# EAGLE design kalypso-usb-v1 (EAGLE 7.7.0)
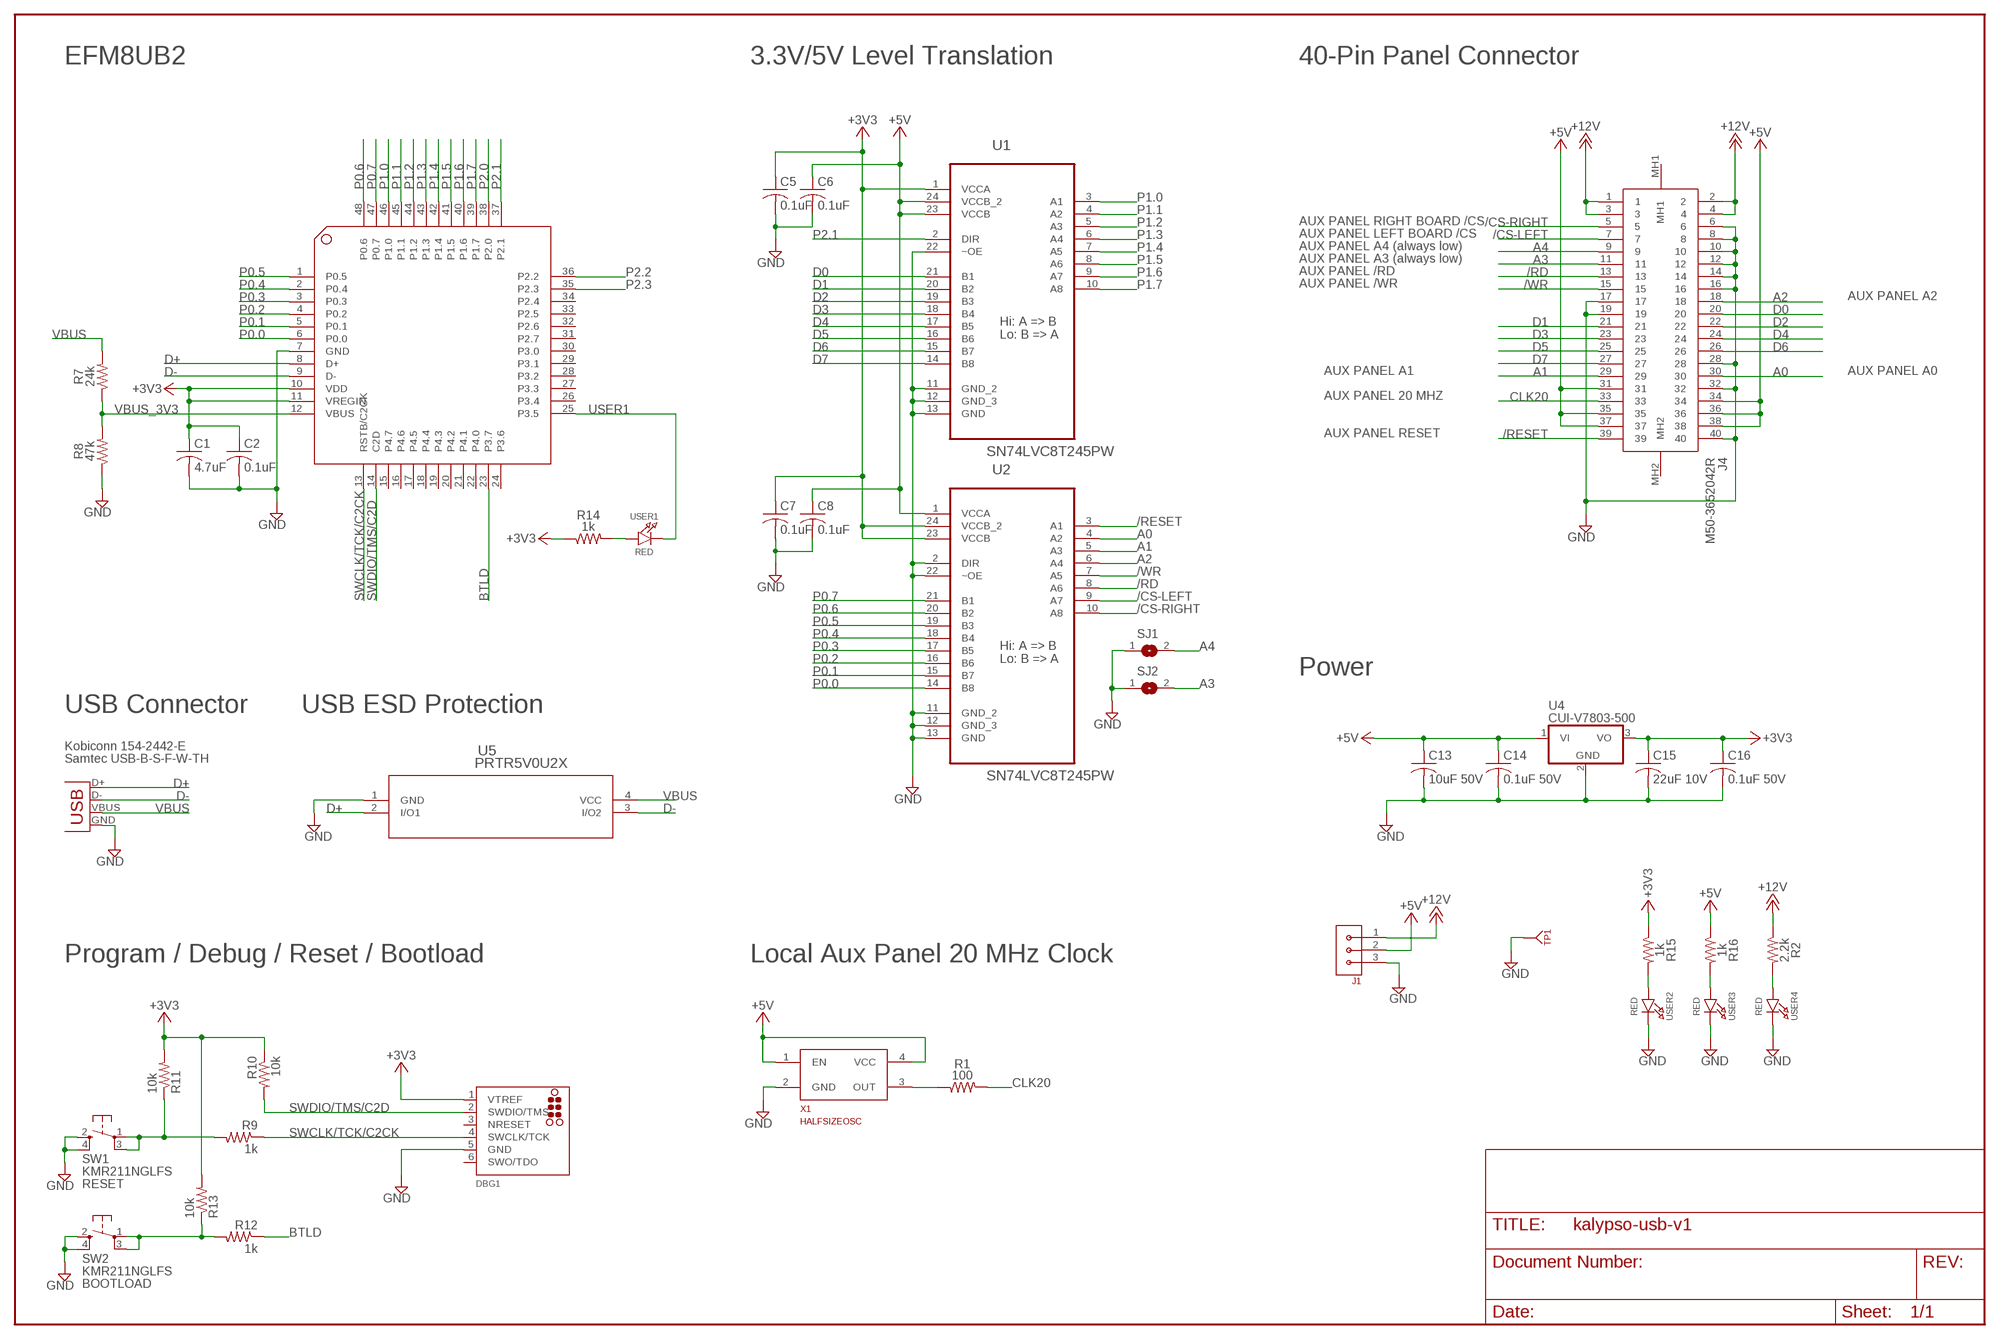
[diagram p0: schematic, sheet 1]

## Parts
C1  4.7uF  C-USC0805K  [C0805K]
C2  0.1uF  C-USC0603K  [C0603K]
C5  0.1uF  C-USC0603K  [C0603K]
C6  0.1uF  C-USC0603K  [C0603K]
C7  0.1uF  C-USC0603K  [C0603K]
C8  0.1uF  C-USC0603K  [C0603K]
C13  10uF 50V  C-USC1210K  [C1210K]
C14  0.1uF 50V  C-USC1206K  [C1206K]
C15  22uF 10V  C-USC1206K  [C1206K]
C16  0.1uF 50V  C-USC1206K  [C1206K]
DBG1  TC2030-CTX-SWD  [TC2030-MCP-NL]
J1  CON-3.81MM-1X3-PHOENIX-RA  [CON-PHOENIX-3.81-1X3-RA]
J2  USB-B  USBPTH  [USB-B-PTH]
J4  M50-3652042R  [M503652042R]
R1  100  R-US_R0603  [R0603]
R2  2.2k  R-US_R0603  [R0603]
R7  24k  R-US_R0603  [R0603]
R8  47k  R-US_R0603  [R0603]
R9  1k  R-US_R0603  [R0603]
R10  10k  R-US_R0603  [R0603]
R11  10k  R-US_R0603  [R0603]
R12  1k  R-US_R0603  [R0603]
R13  10k  R-US_R0603  [R0603]
R14  1k  R-US_R0603  [R0603]
R15  1k  R-US_R0603  [R0603]
R16  1k  R-US_R0603  [R0603]
SJ1  SJ  [SJ]
SJ2  SJ  [SJ]
SW1  KMR211NGLFS  SPST_TACT-KMR2  [KMR2]
SW2  KMR211NGLFS  SPST_TACT-KMR2  [KMR2]
TP1  KEYSTONE_500X  [KEYSTONE_TP500X]
U1  SN74LVC8T245PW  SN74AVC8T245PW  [SOP65P640X120-24N]
U2  SN74LVC8T245PW  SN74AVC8T245PW  [SOP65P640X120-24N]
U4  CUI-V7803-500  [CUI-78XX-500]
U5  PRTR5V0U2X  [SOT143B]
U6  EFM8UB20F64G-B-QFP48  [EFM8UB2-QFP48]
USER1  RED  LED0805_NOOUTLINE  [CHIPLED_0805_NOOUTLINE]
USER2  RED  LED0805_NOOUTLINE  [CHIPLED_0805_NOOUTLINE]
USER3  RED  LED0805_NOOUTLINE  [CHIPLED_0805_NOOUTLINE]
USER4  RED  LED0805_NOOUTLINE  [CHIPLED_0805_NOOUTLINE]
X1  HALFSIZEOSC  [HALFSIZEOSC]

## Nets
+3V3: C1.1 C2.1 C5.1 C7.1 C15.1 C16.1 DBG1.1(VTREF) R10.1 R11.2 R13.2 R14.1 R15.1 U1.1(VCCA) U2.23(VCCB) U2.24(VCCB_2) U4.3(VO) U6.10(VDD) U6.11(VREGIN)
+5V: C6.1 C8.1 C13.1 C14.1 J1.2 J4.31 J4.34 J4.35 J4.36 J4.37 J4.38 R16.1 U1.23(VCCB) U1.24(VCCB_2) U2.1(VCCA) U4.1(VI) X1.1(EN) X1.4(VCC)
+12V: J1.1 J4.1 J4.2 J4.3 J4.4 R2.1
/CS-LEFT: J4.7 U2.9(A7)
/CS-RIGHT: J4.5 U2.10(A8)
/RD: J4.13 U2.8(A6)
/RESET: J4.39 U2.3(A1)
/WR: J4.15 U2.7(A5)
A0: J4.30 U2.4(A2)
A1: J4.29 U2.5(A3)
A2: J4.18 U2.6(A4)
A3: J4.11 SJ2.2
A4: J4.9 SJ1.2
BTLD: R12.1 U6.23(P3.7)
CLK20: J4.33 R1.2
D0: J4.20 U1.21(B1)
D1: J4.21 U1.20(B2)
D2: J4.22 U1.19(B3)
D3: J4.23 U1.18(B4)
D4: J4.24 U1.17(B5)
D5: J4.25 U1.16(B6)
D6: J4.26 U1.15(B7)
D7: J4.27 U1.14(B8)
D+: J2.D+ U5.2(I/O1) U6.8(D+)
D-: J2.D- U5.3(I/O2) U6.9(D-)
GND: C1.2 C2.2 C5.2 C6.2 C7.2 C8.2 C13.2 C14.2 C15.2 C16.2 DBG1.5(GND) J1.3 J2.GND J4.6 J4.8 J4.10 J4.12 J4.14 J4.16 J4.17 J4.19 J4.28 J4.32 J4.40 R8.1 SJ1.1 SJ2.1 SW1.2(S) SW1.4(S1) SW2.2(S) SW2.4(S1) TP1.1 U1.11(GND_2) U1.12(GND_3) U1.13(GND) U1.22(~OE) U2.2(DIR) U2.11(GND_2) U2.12(GND_3) U2.13(GND) U2.22(~OE) U4.2(GND) U5.1(GND) U6.7(GND) USER2.C USER3.C USER4.C X1.2(GND)
N$1: R1.1 X1.3(OUT)
N$2: R14.2 USER1.A
N$3: R15.2 USER2.A
N$4: R16.2 USER3.A
N$5: R2.2 USER4.A
P0.0: U2.14(B8) U6.6(P0.0)
P0.1: U2.15(B7) U6.5(P0.1)
P0.2: U2.16(B6) U6.4(P0.2)
P0.3: U2.17(B5) U6.3(P0.3)
P0.4: U2.18(B4) U6.2(P0.4)
P0.5: U2.19(B3) U6.1(P0.5)
P0.6: U2.20(B2) U6.48(P0.6)
P0.7: U2.21(B1) U6.47(P0.7)
P1.0: U1.3(A1) U6.46(P1.0)
P1.1: U1.4(A2) U6.45(P1.1)
P1.2: U1.5(A3) U6.44(P1.2)
P1.3: U1.6(A4) U6.43(P1.3)
P1.4: U1.7(A5) U6.42(P1.4)
P1.5: U1.8(A6) U6.41(P1.5)
P1.6: U1.9(A7) U6.40(P1.6)
P1.7: U1.10(A8) U6.39(P1.7)
P2.0: U6.38(P2.0)
P2.1: U1.2(DIR) U6.37(P2.1)
P2.2: U6.36(P2.2)
P2.3: U6.35(P2.3)
SW1: R9.2 R11.1 SW1.1(P) SW1.3(P1)
SW2: R12.2 R13.1 SW2.1(P) SW2.3(P1)
SWCLK/TCK/C2CK: DBG1.4(SWCLK/TCK) R9.1 U6.13(RSTB/C2CK)
SWDIO/TMS/C2D: DBG1.2(SWDIO/TMS) R10.2 U6.14(C2D)
USER1: U6.25(P3.5) USER1.C
VBUS: J2.VBUS R7.2 U5.4(VCC)
VBUS_3V3: R7.1 R8.2 U6.12(VBUS)
Unconnected: DBG1.6(SWO/TDO) J4.MH1 J4.MH2 U6.15(P4.7) U6.16(P4.6) U6.17(P4.5) U6.18(P4.4) U6.19(P4.3) U6.20(P4.2) U6.21(P4.1) U6.22(P4.0) U6.24(P3.6) U6.26(P3.4) U6.27(P3.3) U6.28(P3.2) U6.29(P3.1) U6.30(P3.0) U6.31(P2.7) U6.32(P2.6) U6.33(P2.5) U6.34(P2.4)

## Notes on the sheet
- EFM8UB2 | 3.3V/5V Level Translation | 40-Pin Panel Connector
- AUX PANEL RIGHT BOARD /CS
- AUX PANEL LEFT BOARD /CS
- AUX PANEL A4 (always low)
- AUX PANEL A3 (always low)
- AUX PANEL /RD
- AUX PANEL /WR
- AUX PANEL A2
- Hi: A => B
  Lo: B => A
- AUX PANEL A1 | AUX PANEL A0
- AUX PANEL 20 MHZ
- AUX PANEL RESET
- Hi: A => B
  Lo: B => A
- Power
- USB Connector | USB ESD Protection
- Kobiconn 154-2442-E
- Samtec USB-B-S-F-W-TH
- Program / Debug / Reset / Bootload | Local Aux Panel 20 MHz Clock
- RESET
- BOOTLOAD

## Power pins joined to a net without a drawn wire
NRESET: DBG1.3(NRESET)

## Library data of the parts
C1 C2 C5-C8 = rcl:C-US: CAPACITOR, American symbol
C13 = rcl:C-US: CAPACITOR, American symbol; MFR: KEMET; MFR_PART_NO: C1210C106K5RACTU
C14 C16 = rcl:C-US: CAPACITOR, American symbol; MFR: KEMET; MFR_PART_NO: C1206S104M5RACTU
C15 = rcl:C-US: CAPACITOR, American symbol; MFR: KEMET; MFR_PART_NO: C1206C226K8RAC7800
DBG1 = tag-connect:TC2030-CTX-SWD
J1 = 0GlenConnectors:CON-3.81MM-1X3-PHOENIX-RA
J2 = SparkFun-Connectors:USB: USB Connectors USB-B-PTH is fully proven SKU : PRT-00139/CONN-08278 USB-miniB is fully proven SKU : PRT-00587 USB-A-PCB is untested. USB-A-H is throughly reviewed, but untested. Spark Fun Electronics SKU : PRT-00437 USB-B-SMT is throughly reviewed, but untested. Needs silkscreen touching up. USB-A-S has not been used/tested USB-MB-H has not been used/tested USB-MICROB has been used. CONN-09505; MFR: KOBICONN; MFR_PART_NO: 154-2442-E; PROD_ID: CONN-08278
J4 = M50-3652042R:M50-3652042R: HARWIN Archer M50, 1.27mm Pitch, 40 Way, 2 Row, Vertical PCB Header, Surface Mount Source: Datasheet <https://componentsearchengine.com/Datasheets/1/M50-3652042R.pdf>; ARROW_PART_NUMBER: M50-3652042R; DESCRIPTION: HARWIN Archer M50, 1.27mm Pitch, 40 Way, 2 Row, Vertical PCB Header, Surface Mount; HEIGHT: 11.6mm; MANUFACTURER_NAME: Harwin; MANUFACTURER_PART_NUMBER: M50-3652042R; MOUSER_PART_NUMBER: 855-M50-3652042R; MOUSER_PRICE-STOCK: https://www.mouser.co.uk/ProductDetail/Harwin/M50-3652042R?qs=gf2s0yP%252B7bfJki3ikJTXrQ%3D%3D
R1 R2 R7-R16 = rcl:R-US_: RESISTOR, American symbol
SJ1 SJ2 = jumper:SJ: SMD solder JUMPER
SW1 SW2 = adafruit:SPST_TACT: SMT 6mm switch, EVQQ2 series http://www.ladyada.net/library/eagle
TP1 = 0GlenConnectors:KEYSTONE_500X
U1 U2 = Texas Instruments_By_element14_Batch_1:SN74AVC8T245PW: TRANSCEIVER; MPN: SN74AVC8T245PW; OC_FARNELL: 1053490; OC_NEWARK: 10J9626; PACKAGE: TSSOP-24; SUPPLIER: Texas Instruments
U4 = GlenPartsLibrary:CUI-V7803-500
U5 = Nexperia_PRTR5V0U2X,215:PRTR5V0U2X; MANUFACTURER_PART_NUMBER: PRTR5V0U2X; VENDOR: NXP
U6 = Glen-EFM8UB2:EFM8UB20F64G-B-QFP48
USER1-USER4 = microbuilder:LED: LED 0603 - 0603 Surface Mount Package 2mA: Green LED - Low Power (3.9mcd, 2ma, 1.7Vf) - Digikey: 475-2709-2-ND Orange LED - Low Power (9.8mcd, 2ma, 1.8Vf) - Digikey: 475-1194-2-ND Red LED - Low Power (5mcd, 2ma, 1.8Vf) - Digikey: 475-1195-2-ND Yellow LED - Low Power (7mcd, 2ma, 1.8Vf) - Digikey: 475-1196-2-ND 5mA: Blue LED - Low Power (17mcd, 5ma, 2.9Vf) - Digikey: LNJ937W8CRACT-ND 0805 - 0805 Surface Mount Package 2mA: Red LED (8.8mcd, 2mA, 1.8Vf, Clear) - Low Power [Digikey: 475-2510-1-ND] Green LED (5mcd, 2mA, 1.8Vf, Clear) - Low Power [Digikey: 475-2730-1-ND] Yellow LED (11.3mcd, 2mA, 1.8Vf, Clear) - Low Power [Digikey: 475-2555-1-ND] 20mA: Red LED (104mcd, 20mA, Diffused) - LS R976 [Digikey: 475-1278-6-ND] Red LED (12mcd, 20mA, 2.0Vf, Clear) - APT2012EC [Digikey: 754-1128-1-ND] Green LED (15mcd, 20mA, 2.2Vf, Clear) - APT2012GC [Digikey: 754-1131-1-ND] Orange LED (160mcd, 20mA, 2.1Vf, Clear) - APT2012SECK [Digikey: 754-1130-1-ND] 1206 - 1206 Surface Mount Package Green LED (26mcd, 20mA, Diffused) - LG N971 [Digikey: 475-1407-6-ND] Red LED (15mcd, 20mA, Diffused) - LH N974 [Digikey: 475-1416-6-ND] Cree - Cree High-Power Surface Mount LEDs XPEBWT-L1-0000-00D50 - White 111lm 350mA 2.9Vf 6200K 110° XTEAWT-00-0000-00000LEE3 - White 114lm 350mA 2.85Vf 5000K 115° Everlight - Everlight 45-21 Series Surface Mount LEDs 45-21/QK2C-B2832AC2CB2/2T - Warm White 2000mcd 20mA 3.25Vf 3050K 120° 45-21/LK2C-B38452C4CB2/2T - Nuetral White 2000mcd 20mA 3.25Vf 4150K 120° 45-21/LK2C-B50634C6CB2/2T - Cold White 2200mcd 20mA 3.25Vf 5650K 120° PLCC2 Reverse Mount LS T77K-J1L2-1-0-2-R18-Z - Red 11.25mcd 2mA 1.8Vf 630nm 120° LO T77K-L1M2-24-Z - Orange 19.6mcd 2mA 1.8Vf 606nm 120° LY T77K-K2M1-26-Z - Yellow 15.7mcd 2mA 1.8Vf 587nm 120°
X1 = GlenPartsLibrary:HALFSIZEOSC

## Board
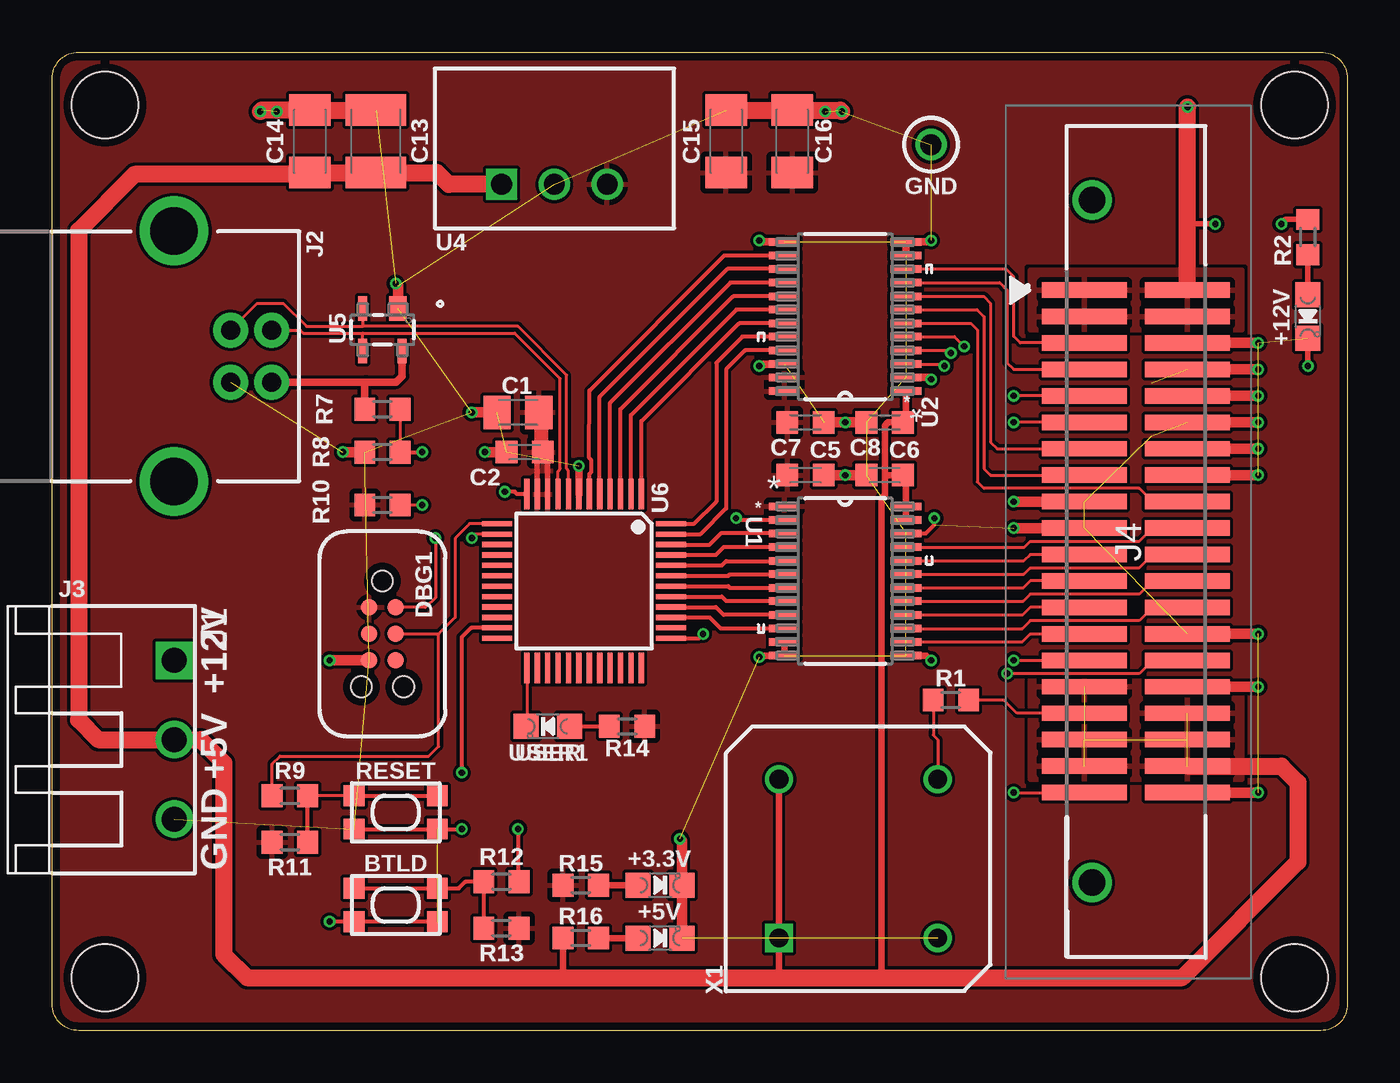
[diagram p1: board, top side]
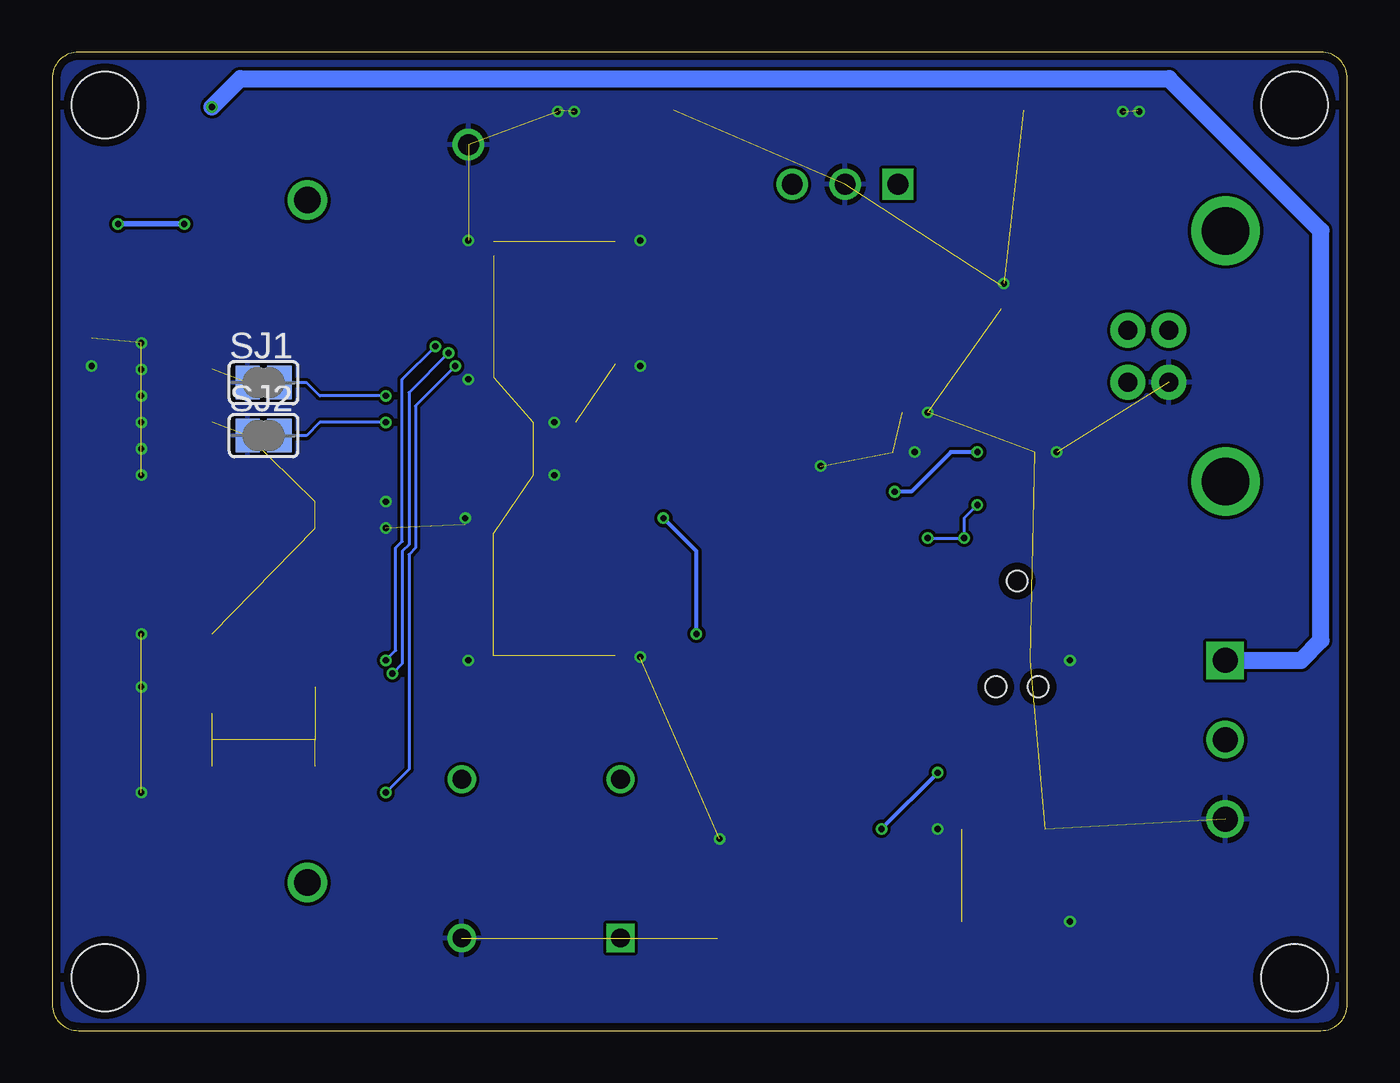
[diagram p2: board, bottom side, seen from below]

Size 62.23 x 46.99 mm. Coordinates in mm from the lower left corner, seen from the top.
Outline: 60.96,46.99 arc-90 62.23,45.72 62.23,1.27 arc-90 60.96,0 1.27,0 arc-90 0,1.27 0,45.72 arc-90 1.27,46.99 60.96,46.99
Copper layers (1*16): Top 0.035559375mm / dielectric 1.6mm / Bottom 0.035559375mm
Design rules "oshpark-2layer-2018": minimum track width 6mil, minimum drill 10mil, track to track 6mil, track to pad 6mil, pad to pad 6mil, via to via 6mil, smd to smd 6mil, copper to edge 15mil, drill to drill 6mil, minimum pad ring 5mil, minimum via ring 5mil, stop-mask expansion 2.5mil, vias tented up to drill 0mil, thermal gap 10mil
Holes 3.2 mm at 2.54,44.45 2.54,2.54 59.69,44.45 59.69,2.54

### Footprints (pad centres in the part's own frame; a part is rotated, then mirrored left to right if it is on the bottom)
C0805K = smd 1.3 x 1.6: 1 -1,0; 2 1,0
C0603K = smd 1.05 x 1.08: 1 -0.875,0; 2 0.875,0
C1210K = smd 1.5 x 2.9: 1 -1.5,0; 2 1.5,0
C1206K = smd 1.5 x 2: 1 -1.5,0; 2 1.5,0
TC2030-MCP-NL = smd 0.787 x 0.787: 1 1.27,-0.635; 2 1.27,0.635; 3 2.54,-0.635; 4 2.54,0.635; 5 3.81,-0.635; 6 3.81,0.635 | hole 0.991: 0,0; 5.08,-1.016; 5.08,1.016
CON-PHOENIX-3.81-1X3-RA = drill 1.2 square: 1 0,0 | drill 1.2: 2 3.81,0; 3 7.62,0
USB-B-PTH = drill 0.914 pad 1.676: D+ 0,1.25; D- 1.981,1.25; GND 0,-1.25; VBUS 1.981,-1.25 | drill 2.286: S1 -2.718,-6.02; S2 -2.718,6.02
M503652042R = smd 0.74 x 4.09: 1 -12.065,-2.475; 2 -12.065,2.475; 3 -10.795,-2.475; 4 -10.795,2.475; 5 -9.525,-2.475; 6 -9.525,2.475; 7 -8.255,-2.475; 8 -8.255,2.475; 9 -6.985,-2.475; 10 -6.985,2.475; 11 -5.715,-2.475; 12 -5.715,2.475; 13 -4.445,-2.475; 14 -4.445,2.475; 15 -3.175,-2.475; 16 -3.175,2.475; 17 -1.905,-2.475; 18 -1.905,2.475; 19 -0.635,-2.475; 20 -0.635,2.475; 21 0.635,-2.475; 22 0.635,2.475; 23 1.905,-2.475; 24 1.905,2.475; 25 3.175,-2.475; 26 3.175,2.475; 27 4.445,-2.475; 28 4.445,2.475; 29 5.715,-2.475; 30 5.715,2.475; 31 6.985,-2.475; 32 6.985,2.475; 33 8.255,-2.475; 34 8.255,2.475; 35 9.525,-2.475; 36 9.525,2.475; 37 10.795,-2.475; 38 10.795,2.475; 39 12.065,-2.475; 40 12.065,2.475 | drill 1.27 pad 1.905: MH1 -16.385,-2.11; MH2 16.385,-2.11
R0603 = smd 1 x 1.1: 1 -0.85,0; 2 0.85,0
SJ = smd 1.168 x 1.6: 1 -0.762,0; 2 0.762,0
KMR2 = smd 1 x 1: 1 2,0.8; 2 2,-0.8; 3 -2,0.8; 4 -2,-0.8
KEYSTONE_TP500X = drill 1.016: 1 0,0
SOP65P640X120-24N = smd 1.473 x 0.356: 1 -2.921,3.581; 2 -2.921,2.921; 3 -2.921,2.286; 4 -2.921,1.626; 5 -2.921,0.965; 6 -2.921,0.33; 7 -2.921,-0.33; 8 -2.921,-0.965; 9 -2.921,-1.626; 10 -2.921,-2.286; 11 -2.921,-2.921; 12 -2.921,-3.581; 13 2.921,-3.581; 14 2.921,-2.921; 15 2.921,-2.286; 16 2.921,-1.626; 17 2.921,-0.965; 18 2.921,-0.33; 19 2.921,0.33; 20 2.921,0.965; 21 2.921,1.626; 22 2.921,2.286; 23 2.921,2.921; 24 2.921,3.581
CUI-78XX-500 = drill 1 square: 1 0,0 | drill 1: 2 2.54,0; 3 5.08,0
SOT143B = smd 0.838 x 1.168: 1 -0.747,-1.016 | smd 0.432 x 1.168: 2 0.95,-1.016; 3 0.95,1.016; 4 -0.95,1.016
EFM8UB2-QFP48 = smd 1.45 x 0.25: 1 -4.175,2.75; 2 -4.175,2.25; 3 -4.175,1.75; 4 -4.175,1.25; 5 -4.175,0.75; 6 -4.175,0.25; 7 -4.175,-0.25; 8 -4.175,-0.75; 9 -4.175,-1.25; 10 -4.175,-1.75; 11 -4.175,-2.25; 12 -4.175,-2.75; 25 4.175,-2.75; 26 4.175,-2.25; 27 4.175,-1.75; 28 4.175,-1.25; 29 4.175,-0.75; 30 4.175,-0.25; 31 4.175,0.25; 32 4.175,0.75; 33 4.175,1.25; 34 4.175,1.75; 35 4.175,2.25; 36 4.175,2.75 | smd 0.25 x 1.45: 13 -2.75,-4.175; 14 -2.25,-4.175; 15 -1.75,-4.175; 16 -1.25,-4.175; 17 -0.75,-4.175; 18 -0.25,-4.175; 19 0.25,-4.175; 20 0.75,-4.175; 21 1.25,-4.175; 22 1.75,-4.175; 23 2.25,-4.175; 24 2.75,-4.175; 37 2.75,4.175; 38 2.25,4.175; 39 1.75,4.175; 40 1.25,4.175; 41 0.75,4.175; 42 0.25,4.175; 43 -0.25,4.175; 44 -0.75,4.175; 45 -1.25,4.175; 46 -1.75,4.175; 47 -2.25,4.175; 48 -2.75,4.175
CHIPLED_0805_NOOUTLINE = smd 1.2 x 1.2: A 0,-1.05; C 0,1.05
HALFSIZEOSC = drill 0.9 square: 1 0,0 | drill 0.9: 2 7.62,0; 3 7.62,7.62; 4 0,7.62

### Placement (x,y rotation side)
C1  22.38,29.69 180 top
C2  22.7,27.78 180 top
C5  36.2,26.67 0 top
C6  40.01,26.67 180 top
C7  36.2,29.21 0 top
C8  40.01,29.21 180 top
C13  15.56,42.7 90 top
C14  12.38,42.7 90 top
C15  32.38,42.7 90 top
C16  35.56,42.7 90 top
DBG1  15.88,21.59 270 top
J1  5.87,17.78 270 top
J2  8.57,32.38 0 top
J4  52.07,23.5 270 top
R1  43.18,15.88 0 top
R2  60.33,38.1 270 top
R7  15.88,29.84 180 top
R8  15.88,27.78 0 top
R9  11.43,11.27 0 top
R10  15.88,25.24 0 top
R11  11.43,9.05 180 top
R12  21.59,7.14 180 top
R13  21.59,4.92 0 top
R14  27.62,14.61 180 top
R15  25.4,6.99 0 top
R16  25.4,4.45 0 top
SJ1  52.07,31.11 0 bottom
SJ2  52.07,28.57 0 bottom
SW1  16.51,10.48 0 top
SW2  16.51,6.03 0 top
TP1  42.23,42.55 180 top
U1  38.1,21.59 0 top
U2  38.1,34.29 180 top
U4  21.59,40.64 0 top
U5  15.88,33.66 180 top
U6  25.56,21.59 270 top
USER1  23.81,14.61 90 top
USER2  29.21,6.99 270 top
USER3  29.21,4.45 270 top
USER4  60.33,34.29 180 top
X1  34.92,4.45 0 top

### Tracks (layer width: path | path; a pad name or v marks a point on that pad's centre or on a via)
+3V3
  Top 0.254: U6.11 23.31,27.51 C2.1 | U6.10 23.81,27.55 C2.1 | C2.1 23.58,29.49 C1.1
  Top 0.305: 35.18,26.81 C5.1
  Top 0.356: 23.34,29.05 23.34,28.1 | 23.65,29.05 23.65,28.1
  pour Top (isolate 0.152, rank 2): 62.23,46.99 62.23,0 0,0 0,46.99
+5V  (5 unrouted)
  Top 0.305: 41.02,26.81 C6.1 | R16.1 24.55,2.6 24.61,2.54 | U2.1 41.02,29.35 C8.1 40.16,29.21 40.01,29.05 40.01,26.67 | 40.01,26.67 40.01,25.72 39.85,25.56 39.85,2.54 | U1.23 U1.24 41.02,26.53 C6.1 | C6.1 40.01,26.67 | 34.92,2.54 X1.1 X1.4
  Top 0.813: J4.38 59.05,12.7 59.85,11.91 59.85,8.1 54.29,2.54 39.85,2.54 34.92,2.54 24.61,2.54 9.37,2.54 8.26,3.65 8.26,12.86 7.14,13.97 J1.2 2.22,13.97 1.27,14.92 1.27,38.42 3.97,41.12 12.29,41.12 C14.1 C13.1 18.49,41.2 19.05,40.64 U4.1
  pour Top (isolate 0.152): 57.15,17.14 57.15,12.06 46.99,12.06 46.99,17.14
+12V  (via drill 0.3)
  Top 0.254: R2.1 59.27,38.95 v59.05,38.73 | v55.88,38.73 54.55,38.73
  Top 0.813: J4.2 54.55,38.73 v54.55,44.36
  Bottom 0.254: v59.05,38.73 v55.88,38.73
  Bottom 0.813: v54.55,44.36 53.18,45.72 8.57,45.72 1.27,38.42 1.27,18.73 2.22,17.78 J1.1
  pour Top (isolate 0.152): 57.15,36.51 57.15,33.66 46.99,33.66 46.99,36.51
/CS-LEFT
  Top 0.152: U2.9 45.52,35.92 45.88,35.56 45.88,32.07 46.2,31.75 J4.7
/CS-RIGHT
  Top 0.152: J4.5 46.51,33.02 46.2,33.34 46.2,36.2 45.81,36.58 U2.10
/RD
  Top 0.152: U2.8 44.76,35.26 45.09,34.92 45.09,28.26 45.4,27.94 J4.13
/RESET  (via drill 0.3)
  Top 0.152: U2.3 42.77,32 v42.86,31.91 | v46.2,11.43 J4.39
  Bottom 0.152: v42.86,31.91 44.77,30 44.77,23.18 45.09,22.86 45.09,12.54 v46.2,11.43
/WR
  Top 0.152: U2.7 44.44,34.62 44.77,34.29 44.77,26.99 45.09,26.67 J4.15
A0  (via drill 0.3)
  Top 0.152: J4.30 52.86,17.78 52.23,17.14 v45.88,17.14 | U2.4 43.06,32.66 v43.18,32.54
  Bottom 0.152: v43.18,32.54 45.09,30.64 45.09,23.34 45.4,23.02 45.4,17.62 v45.88,17.14
A1  (via drill 0.3)
  Top 0.152: U2.5 43.35,33.33 v43.81,32.86 | v46.2,17.78 J4.29
  Bottom 0.152: v46.2,17.78 45.72,18.26 45.72,23.18 45.4,23.5 45.4,31.27 v43.81,32.86
A2
  Top 0.152: U2.6 44.15,33.96 44.45,33.66 44.45,26.35 44.77,26.04 52.23,26.04 52.86,25.4 J4.18
A3  (via drill 0.3)
  Top 0.152: J4.11 v46.2,29.21
  Bottom 0.152: v46.2,29.21 49.37,29.21 50.01,28.57 SJ2.2
A4  (via drill 0.3)
  Top 0.152: J4.9 v46.2,30.48
  Bottom 0.152: v46.2,30.48 49.37,30.48 50.01,31.11 SJ1.2
BTLD  (via drill 0.3)
  Top 0.203: U6.23 20.13,19.34 19.68,18.89 v19.68,12.38 | v22.38,9.68 22.38,7.2 R12.1
  Bottom 0.203: v19.68,12.38 v22.38,9.68
CLK20
  Top 0.152: J4.33 46.35,15.24 45.72,15.88 R1.2
D0
  Top 0.152: U1.21 46.71,23.22 46.99,23.5 52.23,23.5 52.86,24.13 J4.20
D1
  Top 0.152: J4.21 46.99,22.86 46.69,22.55 U1.20
D2
  Top 0.152: U1.19 46.69,21.92 46.99,22.23 52.23,22.23 52.86,22.86 J4.22
D3
  Top 0.152: J4.23 46.99,21.59 46.66,21.26 U1.18
D4
  Top 0.152: J4.24 52.86,21.59 52.23,20.95 46.99,20.95 46.66,20.62 U1.17
D5
  Top 0.152: J4.25 46.99,20.32 46.63,19.96 U1.16
D6
  Top 0.152: J4.26 52.86,20.32 52.23,19.68 46.99,19.68 46.61,19.3 U1.15
D7
  Top 0.152: U1.14 46.61,18.67 46.99,19.05 J4.27
D+
  Top 0.152: J2.D+ 8.57,33.66 9.84,34.92 11.11,34.92 12.22,33.81 14.92,33.81 | U5.2 14.93,33.82 14.92,33.81 | 14.92,33.81 22.38,33.81 24.73,31.47 24.73,26.99 24.81,26.86 U6.8
D-
  Top 0.152: 14.92,33.5 22.23,33.5 24.41,31.31 24.41,26.99 24.31,26.85 U6.9 | U5.3 14.93,33.49 14.92,33.5 | J2.D- 11.93,33.63 12.06,33.5 14.92,33.5
GND  (via drill 0.3)  (40 unrouted)
  Top 0.203: SW1.4 SW1.2 v19.68,9.68 | v13.34,5.24 v13.34,5.23 SW2.4 SW2.2 | U1.22 41.97,23.88 42.39,24.29 v42.39,24.61
  Top 0.254: USER4.C v60.33,31.91
  Top 0.305: U1.11 U1.12 34.04,18.01 v33.97,17.94 | U1.13 42,18.01 v42.23,17.78
  Top 0.356: U2.13 34.04,37.87 v33.97,37.94 | v42.23,37.94 42.16,37.87 U2.12 U2.11 | U2.22 34.07,32 v33.97,31.91 | U2.2 42.13,31.37 v42.23,31.27 | U6.7 v25.31,27.11
  Top 0.508: U5.1 16.62,35.77 v16.51,35.88 | C7.2 v38.1,29.21 C8.2 | C5.2 v38.1,26.67 C6.2 | R8.1 v13.97,27.78 | C2.2 v20.8,27.78 | C1.2 v20.16,29.69 | DBG1.5 v13.34,17.78 | J4.6 v57.94,33.02 | J4.8 v57.94,31.75 | J4.10 v57.94,30.48 | J4.12 v57.94,29.21 | J4.14 v57.94,27.94 | J4.16 v57.94,26.67 | J4.28 v57.94,19.05 | J4.32 v57.94,16.51 | J4.40 v57.94,11.43 | J4.17 v46.2,25.4 | J4.19 v46.2,24.13 | USER3.C USER2.C 30.26,9.11 v30.16,9.21
  Top 0.813: v10,44.13 10.07,44.2 C14.2 C13.2 | C15.2 C16.2 37.87,44.2 v37.94,44.13
  other vias: 10.79,44.13 37.15,44.13
  pour Bottom (isolate 0.152): 62.23,46.99 62.23,0 0,0 0,46.99
N$1
  Top 0.152: R1.1 42.33,14.19 42.55,13.97 X1.3
N$2
  Top 0.203: USER1.A R14.2
N$3
  Top 0.305: R15.2 USER2.A
N$4
  Top 0.305: R16.2 USER3.A
N$5
  Top 0.254: R2.2 USER4.A
P0.0
  Top 0.203: U6.6 25.81,26.72 25.92,26.83 25.92,27.38 25.8,27.5 25.81,30.73 32.29,37.21 U2.14
P0.1
  Top 0.203: U6.5 26.31,30.44 32.45,36.58 U2.15
P0.2
  Top 0.203: U6.4 26.81,30.14 32.58,35.92 U2.16
P0.3
  Top 0.203: U6.3 27.31,29.85 32.72,35.26 U2.17
P0.4
  Top 0.203: U6.2 27.81,29.55 32.87,34.62 U2.18
P0.5
  Top 0.203: U6.1 28.31,29.26 33.01,33.96 U2.19
P0.6
  Top 0.203: U2.20 33.17,33.33 31.91,32.07 31.91,25.4 30.85,24.34 U6.48
P0.7
  Top 0.203: U2.21 33.3,32.66 32.38,31.75 32.38,25.08 31.14,23.84 U6.47
P1.0
  Top 0.203: U6.46 31.59,23.34 32.13,23.88 U1.3
P1.1
  Top 0.203: U6.45 31.89,22.84 32.26,23.22 U1.4
P1.2
  Top 0.203: U6.44 32.18,22.34 32.38,22.54 35.17,22.54 U1.5
P1.3
  Top 0.203: U6.43 32.48,21.84 32.54,21.91 35.17,21.91 U1.6
P1.4
  Top 0.203: U6.42 32.48,21.34 32.54,21.27 35.17,21.27 U1.7
P1.5
  Top 0.203: U6.41 32.18,20.84 32.38,20.64 35.17,20.64 U1.8
P1.6
  Top 0.203: U6.40 31.89,20.34 32.26,19.96 U1.9
P1.7
  Top 0.203: U6.39 31.59,19.84 32.13,19.3 U1.10
P2.1  (via drill 0.3)
  Top 0.203: U6.37 31.06,18.84 v31.27,19.05 | U1.2 32.96,24.51 v32.86,24.61
  Bottom 0.203: v31.27,19.05 31.27,23.02 v32.86,24.61
SW1
  Top 0.152: SW1.3 R9.2
  Top 0.203: R11.1 R9.2 | SW1.3 SW1.1
SW2
  Top 0.203: SW2.3 SW2.1 19.53,6.83 19.84,7.14 R12.2 R13.1
SWCLK/TCK/C2CK
  Top 0.152: U6.13 20.05,24.34 19.37,23.65 19.37,19.84 18.57,19.05 | DBG1.4 18.57,19.05 | R9.1 10.58,12.8 10.95,13.18 18.1,13.18 18.57,13.65 18.57,19.05
SWDIO/TMS/C2D  (via drill 0.3)
  Top 0.152: v18.41,23.65 18.41,20.8 17.94,20.32 DBG1.2 | R10.2 v17.78,25.24 | U6.14 20.35,23.84 v20.16,23.65
  Bottom 0.152: v17.78,25.24 18.41,24.61 v18.41,23.65 v20.16,23.65
USER1
  Top 0.152: U6.25 22.81,14.65 USER1.C
VBUS
  Top 0.152: U5.4 | 15.03,31.08 15.08,31.14
  Top 0.356: J2.VBUS 15.08,31.14 16.53,31.14 16.83,31.43 U5.4 | R7.2 15.03,31.08
VBUS_3V3  (via drill 0.3)
  Top 0.152: R7.1 R8.2
  Top 0.203: R8.2 v17.78,27.78 | U6.12 22.34,25.77 22.23,25.88 v21.75,25.88
  Bottom 0.203: v17.78,27.78 19.05,27.78 20.95,25.88 v21.75,25.88

### Text on the board
_tsilk: C14 | C13 | C15 | C16 | GND | J2 | U4 | R2 | U5 | +12V | C1 | R7 | * | U2 | R8 | C7 | C8 | C2 | C5 | C6 | R10 | U6 | * | U1 | DBG1 | J3 | +12V | R1 | +5V | USER | R14 | R9 | RESET | GND | R11 | BTLD | R12 | R15 | +3.3V | R16 | +5V | R13 | X1